# EAGLE design WeMos-Lora (EAGLE 6.5.0)
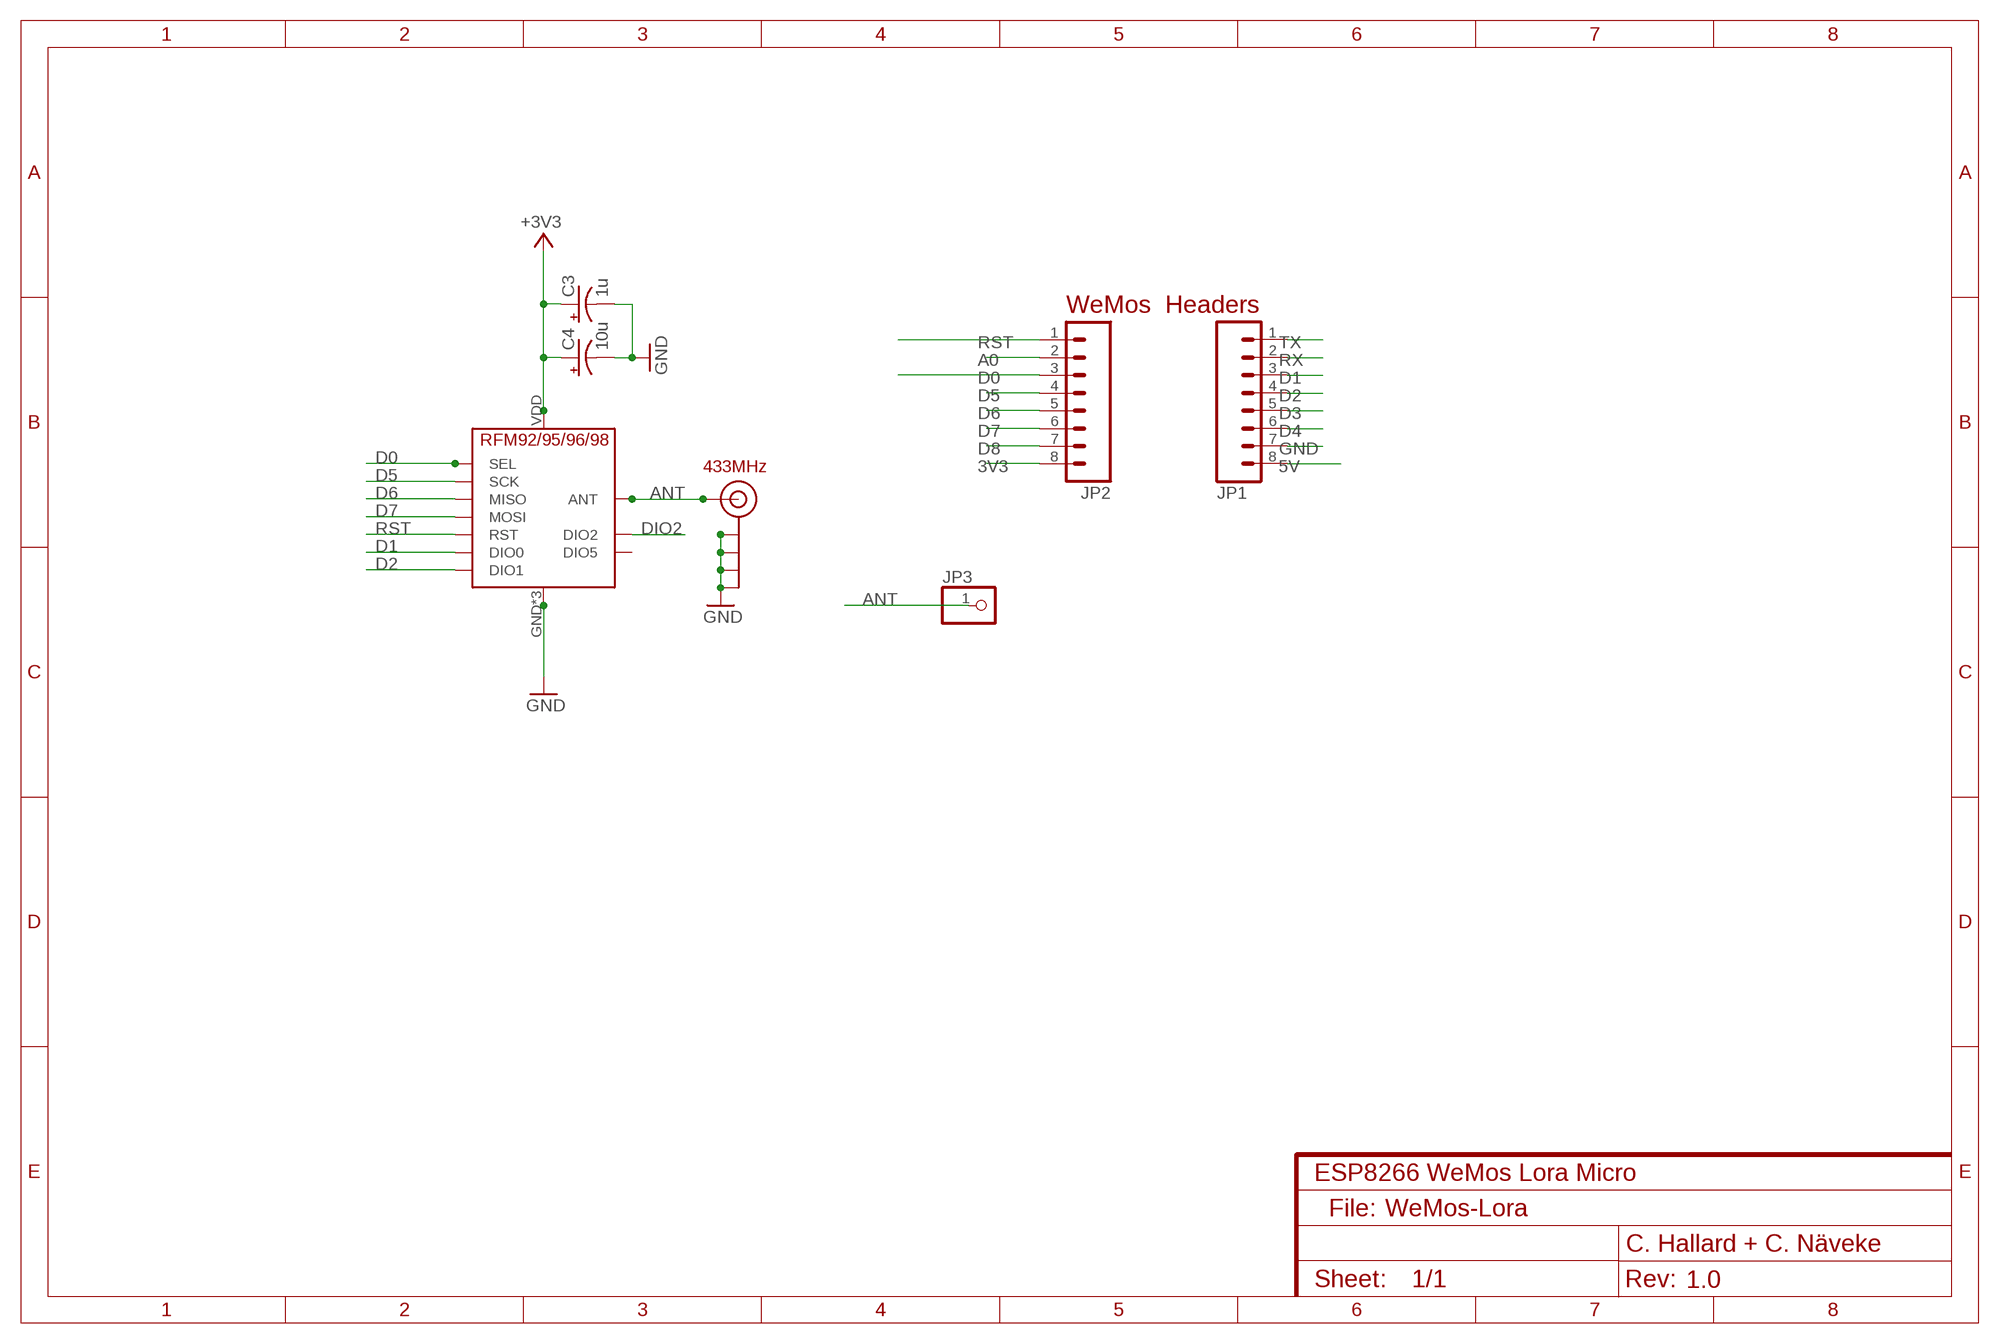
[diagram p0: schematic, sheet 1]
NAME (FRAME-A4L): CNAME: ESP8266 WeMos Lora Micro; CREVISION: 1.0; DESIGNER: C. Hallard + C. Näveke

## Parts
C3  1u  CAP_POLPTH2  [CPOL-RADIAL-10UF-25V]
C4  10u  CAP_POLPTH2  [CPOL-RADIAL-10UF-25V]
J$2  ANTENNATINY  [SMA_UFL_PAD_TINY]
JP1  M08NO_SILK_FEMALE_PTH  [1X08_NO_SILK]
JP2  M08NO_SILK_FEMALE_PTH  [1X08_NO_SILK]
JP3  PINHD-1X1  [1X01]
U$5  RFM95  [RFM95]

## Nets
3V3: C3.1(+) C4.1(+) JP2.8 U$5.VDD(VCC) ; supply symbol labelled +3V3
5V: JP1.8
A0: JP2.2
ANT: J$2.ANT1(SIGNAL) J$2.ANT2(SIGNAL) J$2.ANT3(SIGNAL) JP3.1 U$5.ANT
D0: JP2.3 U$5.NSS(SEL)
D1: JP1.3 U$5.DIO0
D2: JP1.4 U$5.DIO1
D3: JP1.5
D4: JP1.6
D5: JP2.4 U$5.SCK
D6: JP2.5 U$5.MISO
D7: JP2.6 U$5.MOSI
D8: JP2.7
DIO2: U$5.DIO2
GND: C3.2(-) C4.2(-) J$2.GND1(GND) J$2.GND2(GND) J$2.GND3(GND) J$2.GND4(GND) JP1.7 U$5.GND U$5.GND1(GND) U$5.GND2(GND)
RST: JP2.1 U$5.RST
RX: JP1.2
TX: JP1.1
Unconnected: U$5.DIO5

## Notes on the sheet
- WeMos  Headers
- 433MHz
- File:

## Library data of the parts
C3 C4 = SparkFun-Passives:CAP_POL: Capacitor Polarized These are standard SMD and PTH capacitors. Normally 10uF, 47uF, and 100uF in electrolytic and tantalum varieties. Always verify the external diameter of the through hole cap, it varies with capacity, voltage, and manufacturer. The EIA devices should be standard.
J$2 = _c2h:ANTENNA: SMA Antenna Connector End launch SMA connector. The paste layer has been removed so that the connector can be hand soldered onto the board after reflow.
JP1 JP2 = SparkFun-Connectors:M08: Header 8 Standard 8-pin 0.1" header. Use with straight break away headers (SKU : PRT-00116), right angle break away headers (PRT-00553), swiss pins (PRT-00743), machine pins (PRT-00117), and female headers (PRT-00115).; PROD_ID: CONN-08438
JP3 = pinhead:PINHD-1X1: PIN HEADER
U$5 = _c2h:RFM95

## Net classes
0 default: width 0.406 mm, drill 0.356 mm, clearance 0.406 mm
1 power: width 0.203 mm, clearance 0.152 mm

## Board
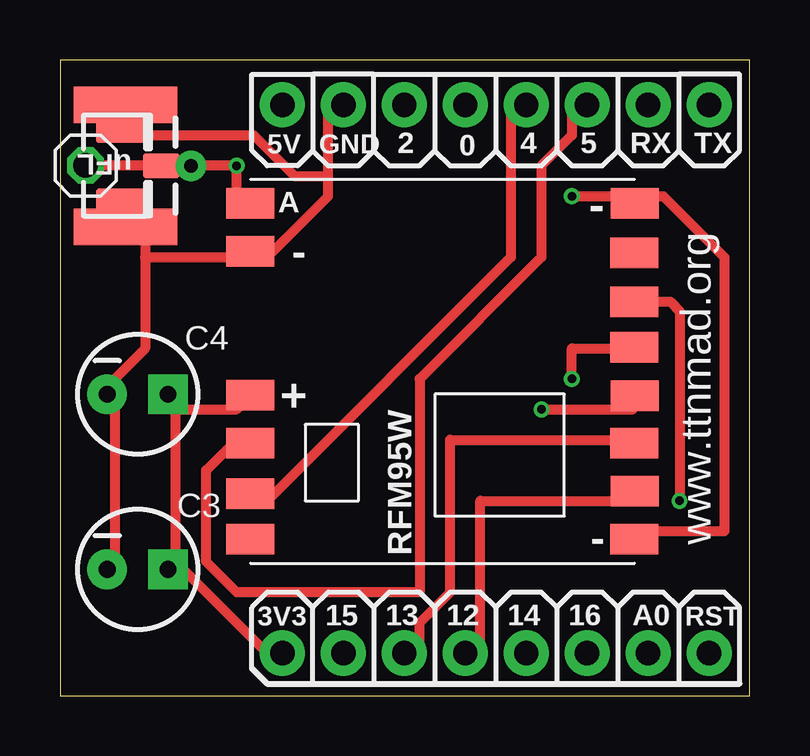
[diagram p1: board, top side]
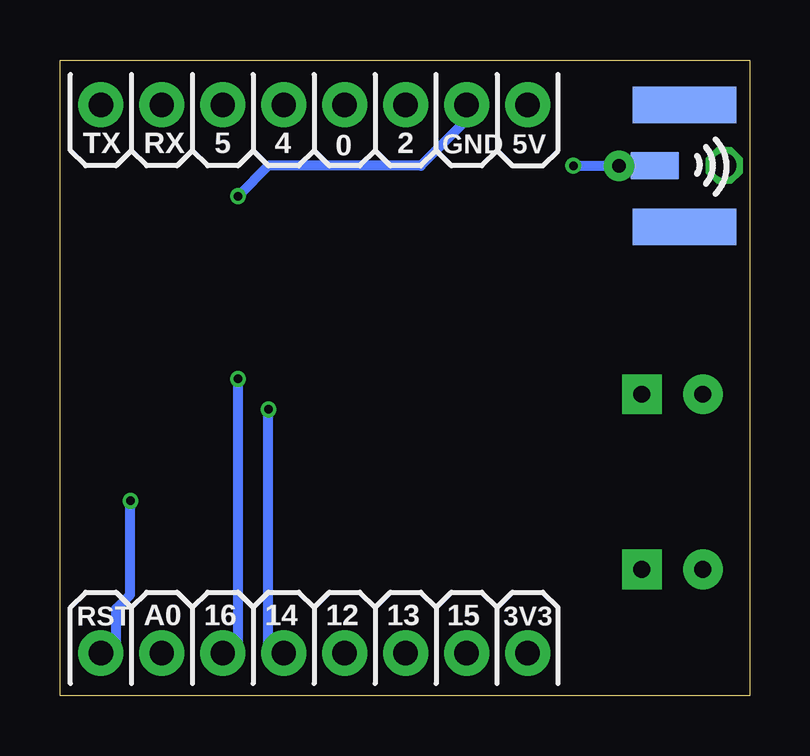
[diagram p2: board, bottom side, seen from below]

Size 28.75 x 26.5 mm. Coordinates in mm from the lower left corner, seen from the top.
Outline: 28.75,26.5 0,26.5 0,0 28.75,0 28.75,26.5
Copper layers (1*16): Top 0.035mm / dielectric 1.5mm / Bottom 0.035mm
Design rules "SmartPrototypingEagleRules": minimum track width 7mil, minimum drill 12mil, track to track 7mil, track to pad 7mil, pad to pad 7mil, via to via 7mil, smd to smd 0mil, copper to edge 20mil, drill to drill 10mil, minimum pad ring 10mil, minimum via ring 6mil, stop-mask expansion 2mil, vias tented up to drill 25mil, thermal gap 10mil

### Footprints (pad centres in the part's own frame; a part is rotated, then mirrored left to right if it is on the bottom)
CPOL-RADIAL-10UF-25V = drill 0.7 pad 1.651 square: 1 1.27,0 | drill 0.7 pad 1.651: 2 -1.27,0
SMA_UFL_PAD_TINY = smd 1.524 x 1.016: ANT1 -3.843,0 | drill 0.559 pad 1.27: ANT2 -5.08,0 | smd 2.032 x 1.143 bottom: ANT3 -3.589,0 | smd 2.2 x 1.016: GND1 -2.223,1.47; GND2 -2.223,-1.47 | smd 4.318 x 1.524: GND3 -2.349,-2.54; GND4 -2.349,2.54 | smd 4.318 x 1.524 bottom: GND5 -2.349,2.54; GND6 -2.349,-2.54
1X08_NO_SILK = drill 1.016 pad 1.88: 1 0,0; 2 2.54,0; 3 5.08,0; 4 7.62,0; 5 10.16,0; 6 12.7,0; 7 15.24,0; 8 17.78,0
1X01 = drill 1.016 octagon: 1 0,0
RFM95 = smd 2 x 1.27: ANT 5.777,-7; DIO0 5.777,3; DIO1 5.779,5.095; DIO2 5.779,7; DIO5 -10.225,-4.936; GND 5.777,-5; GND1 -10.223,7; GND2 -10.23,-7; MISO -10.23,5; MOSI -10.225,3; NSS -10.223,-1; RST -10.223,-2.905; SCK -10.23,1.012; VDD 5.777,1

### Placement (x,y rotation side)
C3  3.23,5.26 0 top
C4  3.23,12.56 0 top
J$2  0.38,22.09 180 top
JP1  27.04,24.63 180 top
JP2  27.04,1.77 180 top
JP3  1.07,22.1 0 top
U$5  13.71,13.52 180 top

### Tracks (layer width: path | path; a pad name or v marks a point on that pad's centre or on a via)
3V3
  Top 0.406: 4.82,11.93 7.36,11.93 U$5.VDD | 4.82,11.93 C4.1 4.82,11.93 | 4.82,5.58 8.63,1.77 JP2.8 | 4.82,5.58 C3.1 4.82,5.58 | 4.82,5.58 4.82,11.93
ANT  (via drill 0.36)
  Top 0.406: J$2.ANT2 v7.36,22.09 7.36,20.82 U$5.ANT | J$2.ANT2 4.82,22.09 J$2.ANT1 | J$2.ANT2 JP3.1
  Bottom 0.406: v7.36,22.09 J$2.ANT2 4.82,22.09 J$2.ANT3
D0  (via drill 0.36)
  Top 0.406: v21.33,13.2 21.33,14.47 23.87,14.47 U$5.NSS
  Bottom 0.406: v21.33,13.2 21.33,1.77 JP2.3
D1
  Top 0.406: U$5.DIO0 7.36,10.66 6.09,9.39 6.09,5.58 7.36,4.31 14.98,4.31 14.98,13.2 20.06,18.28 20.06,22.09 21.33,23.36 21.33,24.63 JP1.3
D2
  Top 0.406: U$5.DIO1 8.63,8.12 18.79,18.28 18.79,24.63 JP1.4
D5  (via drill 0.36)
  Top 0.406: v20.06,11.93 23.87,11.93 U$5.SCK
  Bottom 0.406: v20.06,11.93 20.06,1.77 JP2.4
D6
  Top 0.406: U$5.MISO 23.87,8.12 17.52,8.12 17.52,1.77 JP2.5
D7
  Top 0.406: U$5.MOSI 23.87,10.66 16.25,10.66 16.25,4.31 14.98,3.04 14.98,1.77 JP2.6
GND  (via drill 0.36)
  Top 0.406: 23.87,20.82 25.14,20.82 27.68,18.28 27.68,6.85 23.87,6.85 U$5.GND1 | 23.87,20.82 U$5.GND2 23.87,20.82 | C3.2 2.28,5.58 2.28,11.93 C4.2 2.28,13.2 3.55,14.47 3.55,18.28 | J$2.GND3 3.55,24.63 3.55,23.36 J$2.GND2 2.28,23.36 8.07,23.36 9.79,21.65 11.11,21.65 11.17,21.59 | 3.55,18.28 7.36,18.28 U$5.GND 8.63,18.28 11.17,20.82 11.17,21.59 | 3.55,19.55 3.55,18.28 | 3.55,19.55 J$2.GND4 | 3.55,19.55 3.55,20.82 J$2.GND1 | 3.55,19.55 J$2.GND4 | 11.17,21.59 11.17,24.63 JP1.7 | 2.28,19.55 J$2.GND4 | v21.33,20.82 23.87,20.82
  Bottom 0.406: v21.33,20.82 20.06,22.09 13.71,22.09 11.17,24.63 JP1.7
RST  (via drill 0.36)
  Top 0.406: U$5.RST 25.44,16.42 25.82,16.04 v25.82,8.13 v25.81,8.12
  Bottom 0.406: JP2.1 26.41,1.77 26.41,3.62 25.82,4.21 v25.82,8.11 v25.81,8.12

### Text on the board
tPlace: www.ttnmad.org
tNames: 5V | GND | 2 | 0 | 4 | 5 | RX | TX | RFM95W | 3V3 | 15 | 13 | 12 | 14 | 16 | A0 | RST
bNames: 5V | GND | 2 | 0 | 4 | 5 | RX | TX | 3V3 | 15 | 13 | 12 | 14 | 16 | A0 | RST
200bmp: www.ttnmad.org